# EasyEDA Pro project V2.3.2 Core.epro, board V2.3.2 PCB
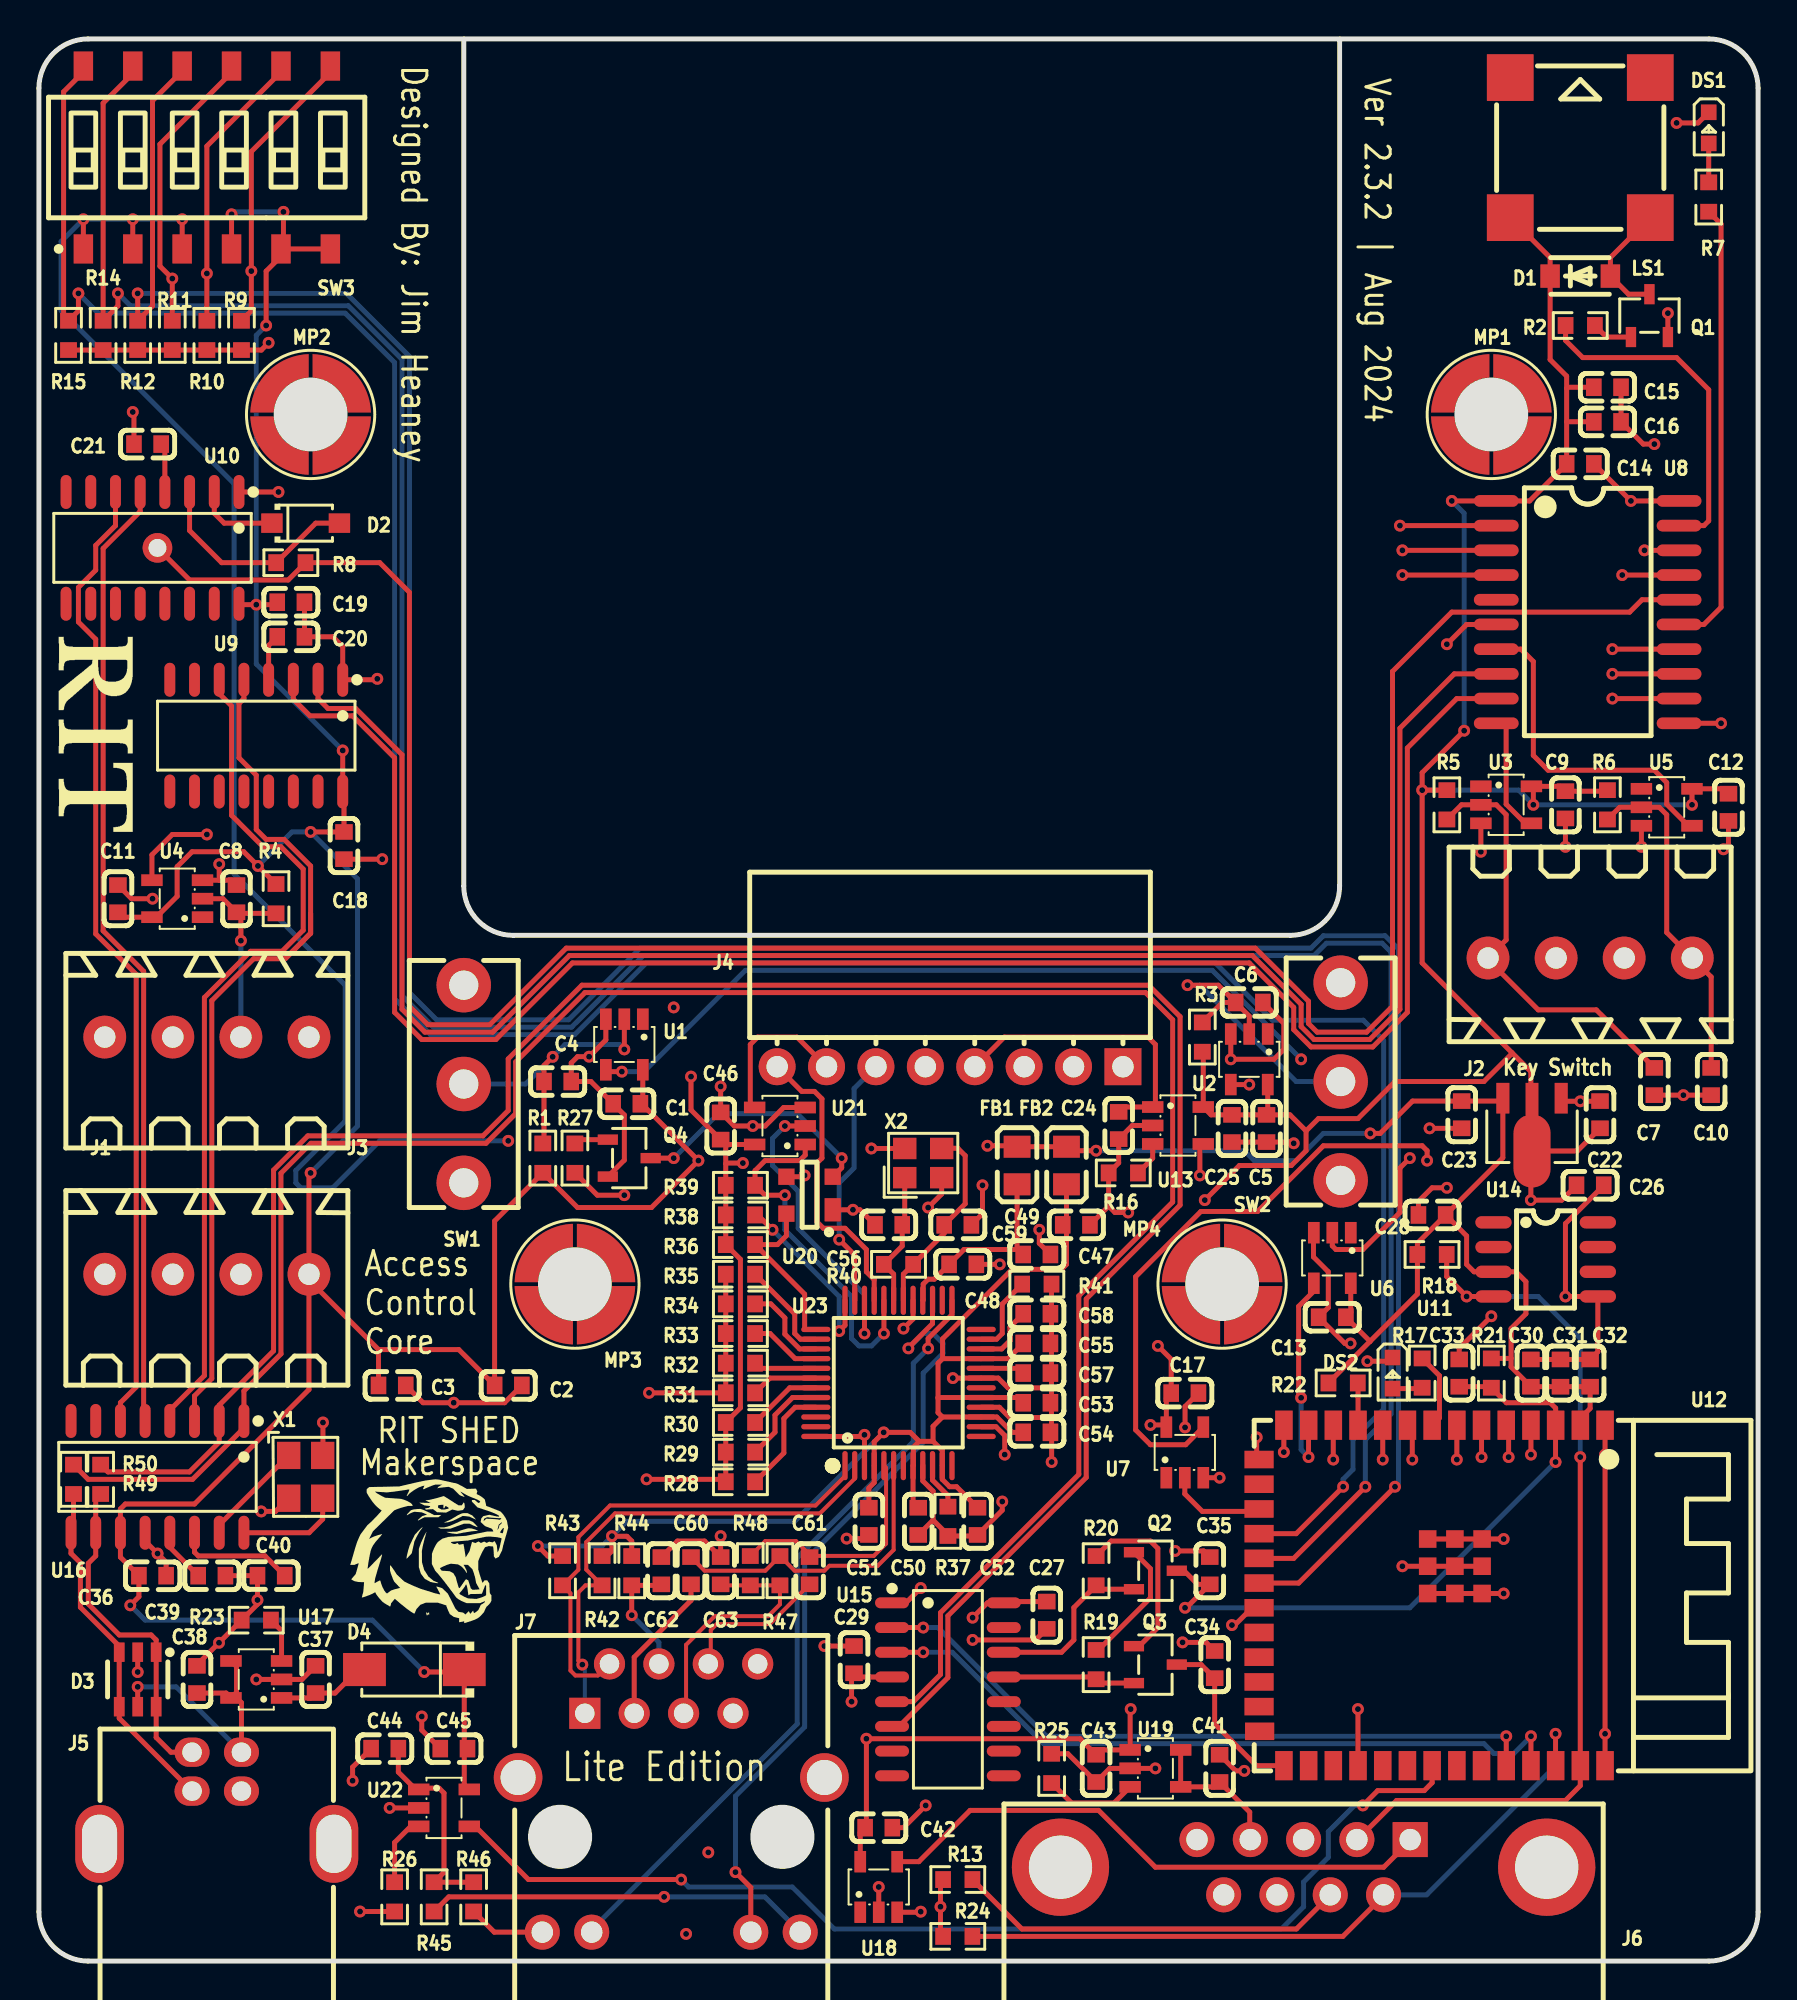
[diagram p6: board, top side]
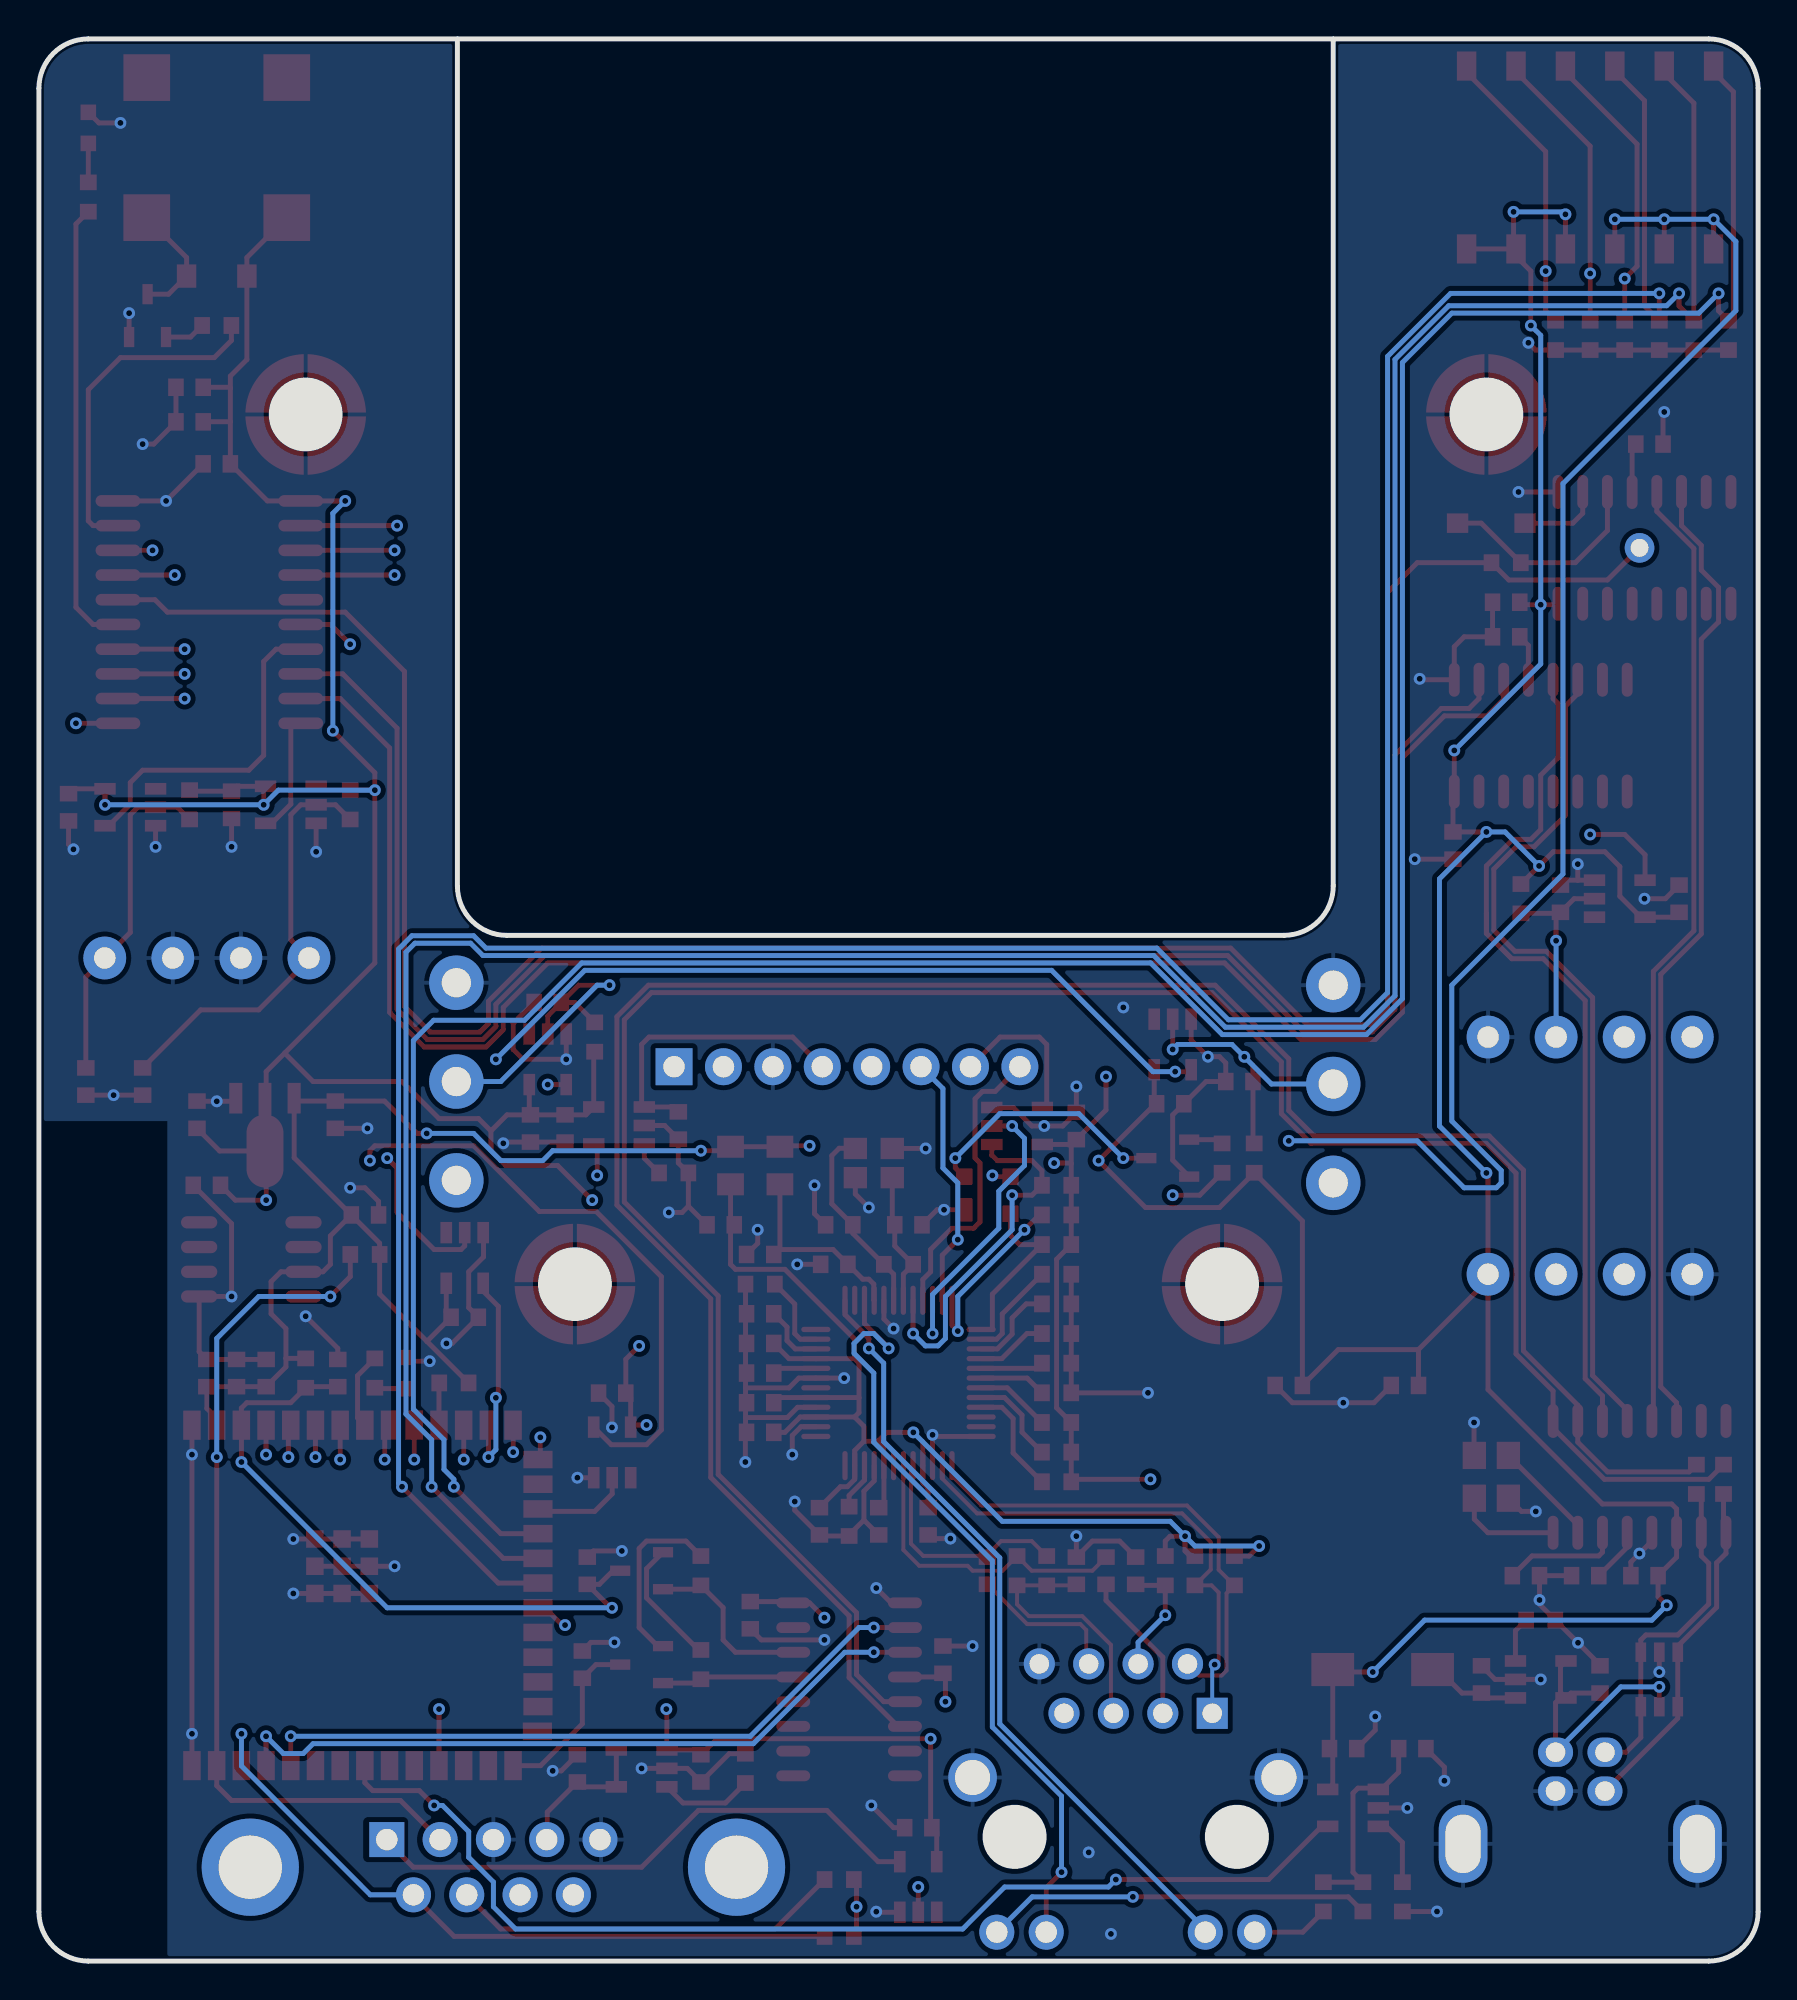
[diagram p7: board, bottom side, seen from below]

Outline 88.39 x 98.81 mm; copper layers: Top Layer, Inner1, Inner2, Bottom Layer. Coordinates in mm from the lower left corner of the outline.
Outline path: 21.84,98.81 21.84,55.27 arc(22.59,53.47) 24.38,52.73 64.34,52.73 arc(66.13,53.47) 66.88,55.27 66.88,98.81 ; 0,96.27 0,2.54 arc(0.74,0.74) 2.54,0 85.85,0 arc(87.65,0.74) 88.39,2.54 88.39,96.27 arc(87.65,98.06) 85.85,98.81 2.54,98.81 arc(0.74,98.06) 0,96.27
Stack: Top Layer 0.035mm 外层铜厚1oz / Dielectric1 0.2104mm 7628 RC49% 8.6mil / Inner1 0.0152mm 内层铜厚 / Dielectric2 1.065mm 1.1mm H/HOZ 含铜 / Inner2 0.0152mm 内层铜厚 / Dielectric3 0.2104mm 7628 RC49% 8.6mil / Bottom Layer 0.035mm 外层铜厚1oz

## Design rules (mm)
net RXP: Eth RX
net TXP: Eth TX
net DN: USB
net DP: USB
net TXN: Eth TX
net RXN: Eth RX
template: Custom Config
spacing copperThickness1oz (default): track to track 0.127, other pairs 0.152 to 0.5
spacing copperThickness2oz: track to track 0.203, other pairs 0.152 to 0.3
track width copperThickness1oz (default): min 0.127, default 0.254, max 2.54
track width copperThickness2oz: min 0.203, default 0.254, max 2.54
differential pair differentialPair (default): width min 0.127, default 0.254, max 2.54; gap min 0.152, default 0.152
via viaSize (default): diameter min 0.5, default 0.61, max 10; hole min 0.3, default 0.305, max 6.299

## Placement (name value [footprint] x y rotation side)
C1  100nF  [C0603]  30.23 44.07 180 top
C2  10uF  [C0603]  24.13 29.59 180 top
C3  10uF  [C0603]  18.16 29.59 180 top
C4  100nF  [C0603]  26.67 45.21 180 top
C5  100nF  [C0603]  63.12 42.8 270 top
C6  100nF  [C0603]  62.23 49.28 180 top
C7  100nF  [C0603]  83.06 45.21 90 top
C8  100nF  [C0603]  10.16 54.61 270 top
C9  100nF  [C0603]  78.49 59.44 90 top
C10  100nF  [C0603]  85.98 45.21 270 top
C11  100nF  [C0603]  4.06 54.61 270 top
C12  100nF  [C0603]  86.87 59.31 90 top
C13  100nF  [C0603]  66.5 33.1 0 top
C14  100nF  [C0603]  79.25 76.96 180 top
C15  10uF  [C0603]  80.65 80.9 180 top
C16  10uF  [C0603]  80.65 79.12 180 top
C17  100nF  [C0603]  58.92 29.2 180 top
C18  100nF  [C0603]  15.69 57.34 90 top
C19  100nF  [C0603]  12.95 69.85 180 top
C20  100nF  [C0603]  12.95 68.07 180 top
C21  100nF  [C0603]  5.59 77.98 0 top
C22  1uF  [C0603]  80.26 43.51 270 top
C23  4.7uF  [C0603]  73.15 43.51 90 top
C24  10uF  [C0603]  55.52 42.95 90 top
C25  10uF  [C0603]  61.34 42.8 270 top
C26  10uF  [C0603]  79.76 39.88 180 top
C27  100nF  [C0603]  51.82 17.78 90 top
C28  100nF  [C0603]  71.63 38.35 0 top
C29  100nF  [C0603]  41.91 15.49 270 top
C30  10uF  [C0603]  76.71 30.23 270 top
C31  1uF  [C0603]  78.23 30.23 270 top
C32  100nF  [C0603]  79.76 30.23 270 top
C33  1uF  [C0603]  73.03 30.23 270 top
C34  100nF  [C0603]  60.45 15.24 270 top
C35  100nF  [C0603]  60.2 20.07 270 top
C36  10uF  [C0603]  5.84 19.81 180 top
C37  10uF  [C0603]  14.22 14.48 270 top
C38  10uF  [C0603]  8.13 14.48 90 top
C39  10uF  [C0603]  8.89 19.81 180 top
C40  10uF  [C0603]  11.94 19.81 0 top
C41  10uF  [C0603]  60.71 9.91 90 top
C42  100nF  [C0603]  43.18 6.86 0 top
C43  10uF  [C0603]  54.36 9.91 90 top
C44  10uF  [C0603]  17.78 10.92 0 top
C45  10uF  [C0603]  21.34 10.92 180 top
C46  100nF  [C0603]  35.05 42.93 90 top
C47  10uF  [C0603]  51.31 36.32 180 top
C48  100nF  [C0603]  47.5 35.81 180 top
C49  10uF  [C0603]  53.34 37.85 180 top
C50  100nF  [C0603]  45.21 22.61 90 top
C51  100nF  [C0603]  42.67 22.61 90 top
C52  100nF  [C0603]  48.26 22.61 90 top
C53  100nF  [C0603]  51.31 28.7 180 top
C54  100nF  [C0603]  51.31 27.18 180 top
C55  100nF  [C0603]  51.31 31.75 180 top
C56  33pF  [C0603]  43.69 37.85 180 top
C57  4.7uF  [C0603]  51.31 30.23 180 top
C58  10nF  [C0603]  51.31 33.27 180 top
C59  33pF  [C0603]  47.24 37.85 0 top
C60  6.8nF  [C0603]  33.53 20.07 90 top
C61  6.8nF  [C0603]  39.62 20.07 90 top
C62  10nF  [C0603]  32 20.07 270 top
C63  10nF  [C0603]  35.05 20.07 270 top
D1  SM4007PL  [SOD-123F_L2.8-W1.8-LS3.7-RD]  79.25 86.61 0 top
D2  1N4148W  [SOD-123F_L2.7-W1.6-LS3.8-RD]  13.72 73.91 0 top
D3  SRV05-4-P-T7  [SOT-23-6_L2.9-W1.6-P0.95-LS2.8-BR]  5.08 14.48 90 top
D4  SS14  [SMA_L4.2-W2.6-LS5.3-RD]  19.3 14.99 180 top
DS1  KT-0603R  [LED0603-RD]  85.85 94.23 270 top
DS2  KT-0603R  [LED0603-RD]  69.6 30.23 270 top
FB1  MH2029-300Y  [L0805]  50.29 40.89 270 top
FB2  MH2029-300Y  [L0805]  52.83 40.89 270 top
J1  DB127S-3.5-4P-GN  [CONN-TH_4P-P3.50_DIBO_DB127S-3.5-4P-GN]  8.64 35.31 0 top
J2  DB127S-3.5-4P-GN  [CONN-TH_4P-P3.50_DIBO_DB127S-3.5-4P-GN]  79.76 51.56 180 top
J3  DB127S-3.5-4P-GN  [CONN-TH_4P-P3.50_DIBO_DB127S-3.5-4P-GN]  8.64 47.5 0 top
J4  PM254-1-08-W-8.5  [HDR-TH_8P-P2.54-H-F-W10.0-N]  46.85 45.97 180 top
J5  U-USBBR04P-F001  [USB-B-TH_U241-041N-1BR85-1]  9.14 8.38 0 top
J6  D-SUB-DR-9PCM-CB  [DB9-TH_ID09S33E4GV00LF]  65.02 4.83 0 top
J7  HC913129AE-907-A  [RJ45-TH_HC911102A-904-A]  32.51 8.38 0 top
LS1  2.7kHz  [BUZ-SMD_4P-L8.5-W8.5-P8.50-TL]  79.25 93.22 90 top
MP1  SMTSO2070CTJ  [SMD_BD5.6-L5.6-W5.6-D3.6]  74.68 79.5 180 top
MP2  SMTSO2070CTJ  [SMD_BD5.6-L5.6-W5.6-D3.6]  13.97 79.5 0 top
MP3  SMTSO2070CTJ  [SMD_BD5.6-L5.6-W5.6-D3.6]  27.56 34.8 0 top
MP4  SMTSO2070CTJ  [SMD_BD5.6-L5.6-W5.6-D3.6]  60.83 34.8 0 top
NOREF  -  [Pad_e105]  6.1 72.64 0 top
Q1  S8050 J3Y  [SOT-23-3_L3.0-W1.7-P0.95-LS2.9-BR]  82.8 84.58 270 top
Q2  S8050 J3Y  [SOT-23-3_L3.0-W1.7-P0.95-LS2.9-BR]  57.4 20.07 180 top
Q3  S8050 J3Y  [SOT-23-3_L3.0-W1.7-P0.95-LS2.9-BR]  57.4 15.24 180 top
Q4  S8050 J3Y  [SOT-23-3_L3.0-W1.7-P0.95-LS2.9-BR]  30.35 41.28 180 top
R1  100kΩ  [R0603]  25.91 41.28 270 top
R2  1kΩ  [R0603]  79.25 84.07 0 top
R3  100kΩ  [R0603]  59.82 47.5 270 top
R4  100kΩ  [R0603]  12.19 54.61 270 top
R5  100kΩ  [R0603]  72.39 59.44 270 top
R6  100kΩ  [R0603]  80.65 59.44 270 top
R7  4.7kΩ  [R0603]  85.85 90.68 270 top
R8  470Ω  [R0603]  12.95 71.88 180 top
R9  10kΩ  [R0603]  10.41 83.57 90 top
R10  10kΩ  [R0603]  8.64 83.57 90 top
R11  10kΩ  [R0603]  6.86 83.57 90 top
R12  10kΩ  [R0603]  5.08 83.57 90 top
R13  10kΩ  [R0603]  47.24 4.19 180 top
R14  10kΩ  [R0603]  3.3 83.57 90 top
R15  10kΩ  [R0603]  1.52 83.57 90 top
R16  10kΩ  [R0603]  55.75 40.51 180 top
R17  4.7kΩ  [R0603]  71.12 30.23 90 top
R18  4.7kΩ  [R0603]  71.63 36.32 180 top
R19  10kΩ  [R0603]  54.36 15.24 90 top
R20  10kΩ  [R0603]  54.36 20.07 90 top
R21  10kΩ  [R0603]  74.68 30.23 90 top
R22  10kΩ  [R0603]  67.06 29.72 180 top
R23  10kΩ  [R0603]  11.18 17.53 180 top
R24  5.1kΩ  [R0603]  47.24 1.27 180 top
R25  10kΩ  [R0603]  52.07 9.91 90 top
R26  10kΩ  [R0603]  18.29 3.3 270 top
R27  10kΩ  [R0603]  27.56 41.28 270 top
R28  10kΩ  [R0603]  36.07 24.64 0 top
R29  10kΩ  [R0603]  36.07 26.16 0 top
R30  10kΩ  [R0603]  36.07 27.69 0 top
R31  10kΩ  [R0603]  36.07 29.21 0 top
R32  10kΩ  [R0603]  36.07 30.73 0 top
R33  10kΩ  [R0603]  36.07 32.26 0 top
R34  10kΩ  [R0603]  36.07 33.78 0 top
R35  10kΩ  [R0603]  36.07 35.31 0 top
R36  10kΩ  [R0603]  36.07 36.83 0 top
R37  12.4kΩ  [R0603]  46.74 22.61 90 top
R38  10kΩ  [R0603]  36.07 38.35 0 top
R39  10kΩ  [R0603]  36.07 39.88 0 top
R40  1MΩ  [R0603]  44.2 35.81 180 top
R41  10kΩ  [R0603]  51.31 34.8 0 top
R42  49.9Ω  [R0603]  28.96 20.07 90 top
R43  49.9Ω  [R0603]  26.92 20.07 90 top
R44  10Ω  [R0603]  30.48 20.07 90 top
R45  1kΩ  [R0603]  20.32 3.3 90 top
R46  1kΩ  [R0603]  22.35 3.3 90 top
R47  49.9Ω  [R0603]  38.1 20.07 90 top
R48  49.9Ω  [R0603]  36.58 20.07 90 top
R49  0Ω  [R0603]  1.78 24.77 90 top
R50  0Ω  [R0603]  3.17 24.77 90 top
SW1  K9-1267F  [SW-TH_K9-1267F]  21.84 45.09 270 top
SW2  K9-1267F  [SW-TH_K9-1267F]  66.93 45.21 270 top
SW3  KH-10027B-SMT2.54-6P  [SW-SMD_KINGHELM_KH-10027B-SMT2.54-6P]  8.64 92.71 0 top
U1  SN74LVC1G17DBVR  [SOT-23-5_L3.0-W1.7-P0.95-LS2.8-BR]  30.1 47.12 90 top
U2  SN74LVC1G17DBVR  [SOT-23-5_L3.0-W1.7-P0.95-LS2.8-BR]  62.23 46.36 90 top
U3  SN74LVC1G17DBVR  [SOT-23-5_L3.0-W1.7-P0.95-LS2.8-BR]  75.44 59.44 180 top
U4  SN74LVC1G17DBVR  [SOT-23-5_L3.0-W1.7-P0.95-LS2.8-BR]  7.11 54.61 0 top
U5  SN74LVC1G17DBVR  [SOT-23-5_L3.0-W1.7-P0.95-LS2.8-BR]  83.69 59.31 180 top
U6  SN74LVC1G17DBVR  [SOT-23-5_L3.0-W1.7-P0.95-LS2.8-BR]  66.5 36.14 90 top
U7  SN74LVC1G17DBVR  [SOT-23-5_L3.0-W1.7-P0.95-LS2.8-BR]  58.92 26.15 270 top
U8  ATTINY3216-SNR  [SOIC-20_L12.8-W7.5-P1.27-LS10.3-BL]  79.63 69.34 270 top
U9  CH340C  [SOP-16_L10.0-W3.9-P1.27-LS6.0-BL]  11.18 62.99 180 top
U10  CH340C  [SOP-16_L10.0-W3.9-P1.27-LS6.0-BL]  5.84 72.64 180 top
U11  BL8565CC3BTR33  [SOT-89-3_L4.5-W2.5-P1.50-LS4.2-BR]  76.77 43 90 top
U12  2.4GHz  [WIRELM-SMD_ESP32-S3-WROOM-1]  71.63 18.8 270 top
U13  MT9700  [SOT-23-5_L3.0-W1.7-P0.95-LS2.8-BR]  58.56 42.95 180 top
U14  DS18B20Z  [SOP-8_L4.9-W3.9-P1.27-LS6.0-BL]  77.47 36.07 270 top
U15  CH340C  [SOP-16_L10.0-W3.9-P1.27-LS6.0-BL]  46.74 13.97 270 top
U16  SL2.1A  [SOP-16_L10.0-W3.9-P1.27-LS6.0-BL]  6.1 24.89 180 top
U17  MT9700  [SOT-23-5_L3.0-W1.7-P0.95-LS2.8-BR]  11.18 14.48 0 top
U18  SN74LVC1G17DBVR  [SOT-23-5_L3.0-W1.7-P0.95-LS2.8-BR]  43.18 3.81 270 top
U19  MT9700  [SOT-23-5_L3.0-W1.7-P0.95-LS2.8-BR]  57.4 9.91 180 top
U20  MAX811T  [SOT-143-4_L2.9-W1.3-P1.90-LS2.4-BL-1]  39.62 39.37 90 top
U21  SN74AHC1G125DBVR  [SOT-23-5_L3.0-W1.7-P0.95-LS2.8-BR]  38.1 42.93 0 top
U22  MT9700  [SOT-23-5_L3.0-W1.7-P0.95-LS2.8-BR]  20.83 7.87 180 top
U23  W5500  [LQFP-48_L7.0-W7.0-P0.50-LS9.0-BL]  44.2 29.72 0 top
X1  12MHz  [OSC-SMD_4P-L3.2-W2.5-BL]  13.72 24.89 270 top
X2  25MHz  [CRYSTAL-SMD_4P-L2.5-W2.0-BL]  45.47 41.02 0 top

## Footprints (pads in the part's own frame, mm; a bottom-side part is the same pattern mirrored in y, then rotated)
BUZ-SMD_4P-L8.5-W8.5-P8.50-TL
  rect 2.4x2.4 smd: 1(-3.6,3.6) 2(-3.6,-3.6) 3(3.599,-3.599) 4(3.6,3.6)
C0603
  rect 0.8x0.9 smd: 1(-0.7,0) 2(0.7,0)
CONN-TH_4P-P3.50_DIBO_DB127S-3.5-4P-GN
  round 2.2 hole 1.1: 1(-5.25,0) 2(-1.75,0) 3(1.75,0) 4(5.25,0)
CRYSTAL-SMD_4P-L2.5-W2.0-BL
  rect 1.2x1.1 smd: 1(-0.95,-0.75) 2(0.95,-0.75) 3(0.95,0.75) 4(-0.95,0.75)
DB9-TH_ID09S33E4GV00LF
  rect 1.8x1.8 hole 1.1: 1(5.48,1.42)
  round 1.8 hole 1.1: 2(2.74,1.42) 3(0,1.42) 4(-2.74,1.42) 5(-5.48,1.42) 6(4.11,-1.42) 7(1.37,-1.42) 8(-1.37,-1.42) 9(-4.11,-1.42)
  round 5 hole 3.25: 10(-12.5,0) 11(12.5,0)
HDR-TH_8P-P2.54-H-F-W10.0-N
  rect 1.9x1.9 hole 1.1: 1(-8.89,0)
  round 1.9 hole 1.1: 2(-6.35,0) 3(-3.81,0) 4(-1.27,0) 5(1.27,0) 6(3.81,0) 7(6.35,0) 8(8.89,0)
L0805
  rect 1.133x1.377 smd: 1(-0.966,0) 2(0.966,0)
LED0603-RD
  rect 0.8x0.8 smd: 1(-0.799,0) 2(0.799,0)
LQFP-48_L7.0-W7.0-P0.50-LS9.0-BL
  oval 0.27x1.5 smd: 1(-2.75,-4.25) 2(-2.25,-4.25) 3(-1.75,-4.25) 4(-1.25,-4.25) 5(-0.75,-4.25) 6(-0.25,-4.25) 7(0.25,-4.25) 8(0.75,-4.25) 9(1.25,-4.25) 10(1.75,-4.25) 11(2.25,-4.25) 12(2.75,-4.25) 25(2.75,4.25) 26(2.25,4.25) 27(1.75,4.25) 28(1.25,4.25) 29(0.75,4.25) 30(0.25,4.25) 31(-0.25,4.25) 32(-0.75,4.25) 33(-1.25,4.25) 34(-1.75,4.25) 35(-2.25,4.25) 36(-2.75,4.25)
  oval 1.5x0.27 smd: 13(4.25,-2.75) 14(4.25,-2.25) 15(4.25,-1.75) 16(4.25,-1.25) 17(4.25,-0.75) 18(4.25,-0.25) 19(4.25,0.25) 20(4.25,0.75) 21(4.25,1.25) 22(4.25,1.75) 23(4.25,2.25) 24(4.25,2.75) 37(-4.25,2.75) 38(-4.25,2.25) 39(-4.25,1.75) 40(-4.25,1.25) 41(-4.25,0.75) 42(-4.25,0.25) 43(-4.25,-0.25) 44(-4.25,-0.75) 45(-4.25,-1.25) 46(-4.25,-1.75) 47(-4.25,-2.25) 48(-4.25,-2.75)
OSC-SMD_4P-L3.2-W2.5-BL
  rect 1.4x1.2 smd: 1(-1.1,-0.875) 2(1.1,-0.875) 3(1.1,0.875) 4(-1.1,0.875)
Pad_e105
  round 1.524 hole 0.914: 49(0,0)
R0603
  rect 0.806x0.864 smd: 1(-0.753,0) 2(0.753,0)
RJ45-TH_HC911102A-904-A
  rect 1.6x1.6 hole 1: 1(-4.445,4.355)
  round 1.6 hole 1: 2(-3.175,6.895) 3(-1.905,4.355) 4(-0.635,6.895) 5(0.635,4.355) 6(1.905,6.895) 7(3.175,4.355) 8(4.445,6.895)
  round 1.8 hole 1.1: 9(-6.63,-6.895) 10(-4.09,-6.895) 11(4.09,-6.895) 12(6.63,-6.895)
  round 2.5 hole 1.8: 13(-7.875,1.055) 13(7.875,1.055)
SMA_L4.2-W2.6-LS5.3-RD
  rect 2.2x1.7 smd: 1(-2.566,0) 2(2.566,0)
SMD_BD5.6-L5.6-W5.6-D3.6
  custom 3x3 smd: 1(-1.844,1.6) 1(-1.601,-1.844) 1(1.6,1.844) 1(1.844,-1.6)
SOD-123F_L2.7-W1.6-LS3.8-RD
  rect 1.1x1 smd: 1(-1.735,0) 2(1.735,0)
SOD-123F_L2.8-W1.8-LS3.7-RD
  rect 1x1.2 smd: 1(-1.55,0) 2(1.55,0)
SOIC-20_L12.8-W7.5-P1.27-LS10.3-BL
  oval 0.6x2.3 smd: 1(-5.715,-4.7) 2(-4.445,-4.7) 3(-3.175,-4.7) 4(-1.905,-4.7) 5(-0.635,-4.7) 6(0.635,-4.7) 7(1.905,-4.7) 8(3.175,-4.7) 9(4.445,-4.7) 10(5.715,-4.7) 11(5.715,4.7) 12(4.445,4.7) 13(3.175,4.7) 14(1.905,4.7) 15(0.635,4.7) 16(-0.635,4.7) 17(-1.905,4.7) 18(-3.175,4.7) 19(-4.445,4.7) 20(-5.715,4.7)
SOP-8_L4.9-W3.9-P1.27-LS6.0-BL
  oval 0.63x1.865 smd: 1(-1.905,-2.683) 2(-0.635,-2.683) 3(0.635,-2.683) 4(1.905,-2.683) 5(1.905,2.683) 6(0.635,2.683) 7(-0.635,2.683) 8(-1.905,2.683)
SOP-16_L10.0-W3.9-P1.27-LS6.0-BL
  oval 0.56x1.745 smd: 1(-4.445,-2.873) 2(-3.175,-2.873) 3(-1.905,-2.873) 4(-0.635,-2.873) 5(0.635,-2.873) 6(1.905,-2.873) 7(3.175,-2.873) 8(4.445,-2.873) 9(4.445,2.873) 10(3.175,2.873) 11(1.905,2.873) 12(0.635,2.873) 13(-0.635,2.873) 14(-1.905,2.873) 15(-3.175,2.873) 16(-4.445,2.873)
SOT-23-3_L3.0-W1.7-P0.95-LS2.9-BR
  rect 1.038x0.532 smd: 1(1.101,-0.95) 2(1.101,0.95) 3(-1.101,0)
SOT-23-5_L3.0-W1.7-P0.95-LS2.8-BR
  rect 1.1x0.6 smd: 1(1.3,-0.95) 2(1.3,0) 3(1.3,0.95) 4(-1.3,0.95) 5(-1.3,-0.95)
SOT-23-6_L2.9-W1.6-P0.95-LS2.8-BR
  rect 1x0.55 smd: 1(1.4,-0.95) 2(1.4,0) 3(1.4,0.95) 4(-1.4,0.95) 5(-1.4,0) 6(-1.4,-0.95)
SOT-89-3_L4.5-W2.5-P1.50-LS4.2-BR
  rect 1.575x0.672 smd: 1(1.356,-1.5) 3(1.356,1.5)
  custom 5.377x1.9 smd: 2(-1.356,0)
SOT-143-4_L2.9-W1.3-P1.90-LS2.4-BL-1
  rect 1.194x0.838 smd: 1(-0.75,-1.192)
  rect 0.838x0.838 smd: 2(0.95,-1.192) 3(-0.95,1.192) 4(0.95,1.192)
SW-SMD_KINGHELM_KH-10027B-SMT2.54-6P
  rect 1x1.5 smd: 1(-6.35,-4.7) 2(-3.81,-4.7) 3(-1.27,-4.7) 4(1.27,-4.7) 5(3.81,-4.7) 6(6.35,-4.7) 7(6.35,4.7) 8(3.81,4.7) 9(1.27,4.7) 10(-1.27,4.7) 11(-3.81,4.7) 12(-6.35,4.7)
SW-TH_K9-1267F
  round 2.8 hole 1.5: 1(-5.08,0) 2(0,0) 3(5.08,0)
USB-B-TH_U241-041N-1BR85-1
  oval 1.8x1.5 hole 1: 1(1.27,2.355) 2(-1.27,2.355) 3(-1.27,0.355) 4(1.27,0.355)
  oval 2.5x4 hole 1.8x3: 5(6.025,-2.355) 6(-6.025,-2.355)
WIRELM-SMD_ESP32-S3-WROOM-1
  rect 1.5x0.9 smd: 1(-8.75,8.895) 2(-8.75,7.625) 3(-8.75,6.355) 4(-8.75,5.085) 5(-8.75,3.815) 6(-8.75,2.545) 7(-8.75,1.275) 8(-8.75,0.005) 9(-8.75,-1.265) 10(-8.75,-2.535) 11(-8.75,-3.805) 12(-8.75,-5.075) 13(-8.75,-6.345) 14(-8.75,-7.615) 27(8.75,-7.615) 28(8.75,-6.345) 29(8.75,-5.075) 30(8.75,-3.805) 31(8.75,-2.535) 32(8.75,-1.265) 33(8.75,0.005) 34(8.75,1.275) 35(8.75,2.545) 36(8.75,3.815) 37(8.75,5.085) 38(8.75,6.355) 39(8.75,7.625) 40(8.75,8.895)
  rect 0.9x1.5 smd: 15(-6.985,-8.895) 16(-5.715,-8.895) 17(-4.445,-8.895) 18(-3.175,-8.895) 19(-1.905,-8.895) 20(-0.635,-8.895) 21(0.635,-8.895) 22(1.905,-8.895) 23(3.175,-8.895) 24(4.445,-8.895) 25(5.715,-8.895) 26(6.985,-8.865)
  rect 0.9x0.9 smd: 41(-2.9,2.575) 41(-2.9,1.175) 41(-2.9,-0.225) 41(-1.5,2.575) 41(-1.5,1.175) 41(-1.5,-0.225) 41(-0.1,2.575) 41(-0.1,1.175) 41(-0.1,-0.225)

## Nets
As in the schematic, except:
GND: C1.2 C2.1 C3.1 C4.1 C5.2 C6.1 C7.1 C8.1 C9.1 C10.2 C11.1 C12.1 C13.1 C14.1 C15.1 C16.1 C17.1 C18.1 C19.1 C20.1 C21.1 C22.1 C23.1 C24.1 C25.2 C26.1 C27.1 C28.1 C29.1 C30.1 C31.1 C32.1 C33.1 C34.1 C35.1 C36.1 C37.1 C38.2 C39.1 C40.1 C41.2 C42.2 C43.1 C44.1 C45.2 C46.2 C47.1 C48.1 C49.1 C50.1 C51.1 C52.1 C53.1 C54.1 C55.1 C56.2 C57.1 C58.1 C59.2 C62.1 C63.1 D3.2 DS1.1 DS2.1 J1.1 J2.2 J2.3 J3.4 J4.3 J5.4 J5.5 J5.6 J6.3 J6.5 J7.8 J7.13 Q1.2 Q4.2 R9.1 R10.1 R11.1 R12.1 R14.1 R15.1 R16.2 R23.2 R25.2 R26.2 R31.1 R32.1 R33.1 R34.1 R35.1 R37.1 R41.2 SW1.1 SW2.1 U1.3 U2.3 U3.3 U4.3 U5.3 U6.3 U7.3 U8.20 U9.1 U10.1 U11.1 U12.1 U12.40 U12.41 U13.2 U14.5 U15.1 U16.12 U17.2 U18.3 U19.2 U20.1 U21.3 U22.2 U23.3 U23.9 U23.14 U23.16 U23.19 U23.29 U23.48 X1.2 X1.4 X2.2 X2.4
VCC: C13.2 C23.2 C27.2 C28.2 C29.2 C30.2 C31.2 C32.2 C46.1 FB1.1 FB2.1 R13.2 R18.2 R21.2 R22.2 R24.2 R28.1 R29.1 R30.1 R36.1 R38.1 R39.1 SW3.1 SW3.2 SW3.3 U6.5 U11.3 U12.2 U14.3 U15.4 U15.16 U21.5
DN: D3.1 D3.6 J5.2 R50.1 U16.10
DN1: R50.2 U15.6 U16.2
DN2: U10.6 U16.6
DN3: U9.6 U16.4
DP: D3.3 D3.4 J5.3 R49.1 U16.9
DP1: R49.2 U15.5 U16.1
DP2: U10.5 U16.5
DP3: U9.5 U16.3
ETH_LEDS: U12.33 U22.4
UPDI: NOREF.49 R8.1 U8.16

Pads without a net: J1 2; J3 1 2; J6 8 9 10 11; J7 7; LS1 3 4; MP1 1; MP2 1; MP3 1; MP4 1; SW1 3; SW2 3; U1 1; U2 1; U3 1; U4 1; U5 1; U6 1; U7 1; U8 5; U9 7 8 9 10 11 12 13 14 15; U10 7 8 9 10 11 12 13 14 15; U12 16 22 23 24 25 26 28 29 31 32 34 35; U14 1 2 6 7 8; U15 7 8 9 10 11 12 15; U16 7 8; U18 1; U23 7 12 13 18 24 26 46 47

## Via types
v1: diameter 0.61, hole 0.305, Top Layer to Bottom Layer, 186 vias

## Routing (per net, layer and track width the routed paths; a pad name or vN(x,y) marks a point on that pad's centre or on a via; arc(x,y) is an arc through that point)
+5V: length 380.6
  Top Layer w0.254: v1(15.62,62.23) 15.62,60.12 15.69,60.05 C18.2 v1(13.97,58.04) ; v1(84.99,59.44) 84.99,60.26 86.62,60.26 C12.2 ; v1(57.53,31.62) 58.22,30.94 C17.2 57.97,28.95 U7.5 57.85,27.56 v1(57.15,27.56) ; 65.15,42.67 65.15,41.66 64.39,40.89 61.72,40.89 v1(59.94,39.12) ; 65.15,42.67 64.32,43.5 C5.1 ; 65.15,42.67 65.79,43.31 67.82,43.31 69.72,45.21 74.29,45.21 75.74,46.66 75.74,46.69 ; U11.2 76.71,41.58 v1(76.71,39.12) 78.29,39.12 C26.2 ; U11.2 76.71,41.7 76.71,45.72 75.74,46.69 ; U11.2 79.1,41.64 C22.2 ; R6.1 80.59,60.14 C9.2 78.24,60.39 U3.5 76.84,60.29 v1(76.84,59.44) ; 78.55,79.13 C14.2 76.64,75.06 U8.1 v1(72.64,75.06) ; 78.55,79.13 78.55,80.85 ; 78.55,79.13 79.94,79.13 79.94,79.12 ; SW3.5 12.57,88.14 v1(12.57,89.92) ; SW3.5 SW3.6 ; SW3.5 12.45,87.63 11.68,86.87 v1(11.68,84.07) ; v1(71.12,60.19) 71.12,61.09 v1(73.28,63.25) ; v1(71.12,60.19) 71.12,51.31 75.74,46.69 ; v1(71.12,60.19) R5.1 ; 13.89,35.01 13.89,29.38 8,23.5 4.44,23.5 4.19,23.24 U16.11 4.19,20.76 C36.2 5.14,18.73 v1(4.7,18.29) ; 13.89,35.01 17.46,31.43 ; 13.89,35.01 J1.4 13.89,40.43 v1(13.97,40.51) ; 78.55,80.85 78.59,80.9 79.94,80.9 ; 78.55,80.85 78.55,81.47 77.7,82.32 D1.1 77.7,87.57 LS1.1 ; C5.1 63.18,43.56 63.18,45.06 ; C5.1 C25.1 60.27,43.5 U13.5 59.87,46.57 59.69,46.74 ; v1(19.81,14.86) 21.74,14.86 D4.1 21.87,9.08 U22.5 ; 17.46,31.43 C3.2 ; 17.46,31.43 21.59,31.43 C2.2 23.43,38.04 R1.2 27.69,38.74 31.5,38.74 v1(33.91,41.15) 30.99,44.07 C1.1 31.05,44.19 U1.5 ; v1(39.37,40.39) 39.3,40.32 U20.4 ; v1(56.13,12.95) 56.1,12.92 U19.1 54.61,10.86 C43.2 53.53,11.43 v1(42.54,11.43) 42.54,6.92 C42.1 42.23,6.61 U18.5 ; C11.2 4.31,53.66 U4.5 6.03,53.66 7.11,54.73 7.11,56.26 7.87,57.02 10.53,57.02 v1(11.26,56.29) R4.1 ; SW3.4 v1(9.91,89.79) ; U10.16 10.29,69.72 v1(11.18,69.72) 12.13,69.72 C19.2
  Inner2 w0.254: v1(57.53,31.62) 57.53,36.7 v1(59.94,39.12) ; v1(33.91,41.15) 34.67,40.39 v1(39.37,40.39) ; v1(42.54,11.43) 41.78,12.19 39.88,12.19 38.48,10.8 26.92,10.8 22.86,14.86 v1(19.81,14.86)
  Inner2 w0.508: v1(57.15,27.56) 56.13,26.54 v1(56.13,12.95)
  Bottom Layer w0.254: v1(11.26,56.29) 13.01,58.04 v1(13.97,58.04) 16.38,55.63 16.38,42.93 v1(13.97,40.51) ; v1(15.62,62.23) 11.18,66.68 v1(11.18,69.72) 11.18,83.57 v1(11.68,84.07) ; v1(4.7,18.29) 5.46,17.53 17.14,17.53 v1(19.81,14.86) ; v1(9.91,89.79) 10.03,89.92 v1(12.57,89.92) ; v1(72.64,75.06) 73.28,74.42 v1(73.28,63.25) ; v1(84.99,59.44) v1(76.84,59.44) 76.08,60.19 v1(71.12,60.19)
AVDD: length 71.4
  Top Layer w0.254: C53.2 50.34,28.97 U23.17 46.24,28.97 46.23,28.96 ; 46.46,30.97 U23.21 49.83,30.97 C55.2 ; 46.46,30.97 46.23,30.73 46.23,28.96 ; 46.46,30.97 46.46,31.98 50.04,35.56 52.58,35.56 52.83,35.81 52.83,37.65 C49.2 52.83,38.04 FB2.2 ; 46.45,27.97 U23.15 49.25,27.97 50.04,27.18 C54.2 ; 46.45,27.97 45.97,27.49 45.97,26.72 ; 46.45,27.97 46.23,28.19 46.23,28.96 ; R44.2 30.48,21.59 30.23,21.84 29.46,21.84 ; 29.46,21.84 29.46,21.08 29.2,20.82 R42.2 ; 29.46,21.84 v1(29.46,21.84) ; C51.2 42.67,24.32 42.95,24.59 U23.4 42.95,26.69 v1(43.43,27.18) 44.8,27.18 45.26,26.72 ; C50.2 44.95,23.57 U23.8 44.96,25.48 44.96,26.42 45.26,26.72 ; 45.97,26.72 45.26,26.72 ; 45.97,26.72 46.45,26.25 U23.11 46.45,24.76 46.82,24.38 47.18,24.38 C52.2 ; v1(25.65,21.34) 26.17,20.82 R43.2
  Bottom Layer w0.254: v1(25.65,21.34) 28.96,21.34 v1(29.46,21.84) 30.23,22.61 38.86,22.61 v1(43.43,27.18)
GND: length 266.8
  Top Layer w0.254: U7.3 v1(60.71,24.85) ; C10.2 v1(84.55,44.51) C7.1 ; C62.1 32.83,21.59 34.23,21.59 C63.1 v1(35.05,21.84) ; U12.40 v1(80.52,11.68) v1(80.52,26.04) U12.1 ; C12.1 86.87,57.4 v1(86.61,57.15) ; v1(49.4,35.81) C48.1 ; C59.2 48.51,38.42 v1(48.51,39.88) ; C21.1 4.89,79.57 v1(4.83,79.63) ; 52.06,27.23 52.07,27.22 v1(52.07,25.65) ; 52.06,27.23 C54.1 ; 52.06,27.23 52.06,27.95 ; C3.1 19.75,28.7 v1(21.33,28.7) 23.94,28.7 C2.1 ; R15.1 R14.1 R12.1 R11.1 R10.1 R9.1 11.44,82.81 v1(11.81,83.19) ; 9.27,55.56 9.91,55.56 C8.1 ; 9.27,55.56 U4.3 ; 9.27,55.56 v1(9.27,56.39) ; v1(49.66,26.04) 49.66,27.02 49.21,27.47 U23.14 ; v1(45.72,38.74) 46.42,39.43 X2.2 ; U23.16 49.38,28.47 49.91,27.94 52.05,27.94 52.06,27.95 ; v1(61.98,9.78) 61.53,9.78 C41.2 ; v1(70.1,20.3) U12.41 U12.41 74.2,20.3 ; X2.4 v1(42.8,41.77) ; v1(49.53,23.62) 49.53,23.18 C52.1 48.21,21.85 R37.1 46.74,21.91 45.97,22.67 ; DS1.1 85.31,94.49 v1(84.2,94.49) ; C49.1 55,38.81 ; 55,38.81 R16.2 55.52,41.03 C24.1 56.22,42.95 U13.2 ; 55,38.81 55.32,38.48 v1(56.01,38.48) ; v1(44.45,32.51) 44.95,33.01 U23.29 ; v1(74.68,33.15) 73.03,31.5 C33.1 ; C37.1 13.52,14.48 U17.2 v1(11.18,14.48) ; U3.3 v1(74.14,57.02) ; U20.1 v1(41.85,38.62) 42.21,38.62 C56.2 ; v1(67.44,31.75) 67.14,31.75 C13.1 66.29,33.59 66.29,35.43 65.53,36.2 65.53,37.43 U6.3 ; C30.1 C31.1 C32.1 80.15,31.32 U14.5 v1(78.49,34.16) 78.49,37.91 C26.1 ; v1(35.05,44.96) C46.2 35.75,42.93 v1(36.7,42.93) 37.34,42.93 38.29,43.88 U21.3 ; U8.20 v1(81.85,75.06) C14.1 ; v1(58.42,21.08) 59.88,21.08 C35.1 ; v1(17.4,65.91) 17.35,65.86 15.62,65.86 15.62,67.56 15.11,68.07 C20.1 C19.1 ; v1(64.52,42.04) 64.45,42.1 C5.2 C25.2 ; v1(45.34,2.54) 45.31,2.51 U18.3 ; C45.2 19.69,11.87 v1(19.69,12.57) ; 29.25,40.33 30.1,41.17 30.1,43.5 C1.2 28.38,45.21 C4.1 27.37,46.17 27.69,46.49 v1(28.29,46.49) 29.15,47.35 U1.3 ; X1.4 14.61,26.01 v1(14.61,27.69) ; 45.97,22.67 C50.1 ; 45.97,22.67 45.97,24.16 45.45,24.68 U23.9 ; v1(48.01,16.51) 51.25,16.51 C27.1 ; v1(46.99,29.97) U23.19 49.32,29.97 49.83,29.46 52.04,29.46 52.06,29.48 ; C29.1 v1(40.39,16.19) ; v1(57.4,9.91) U19.2 55.06,9.91 C43.1 52.9,10.66 R25.2 ; v1(58.93,27.43) 58.93,28.51 C17.1 ; C36.1 6.54,20.51 v1(6.1,20.95) 5.46,21.59 U16.12 ; U23.48 42.36,26.97 v1(42.45,27.05) U23.3 ; 52.06,29.48 52.06,27.95 ; 52.06,29.48 R41.2 ; v1(83.06,77.98) 82.49,77.98 C16.1 C15.1 ; v1(75.31,21.7) U12.41 U12.41 ; v1(5.84,54.61) 4.76,54.61 C11.1 ; Q1.2 v1(83.75,84.71) ; C38.2 8.13,15.23 v1(9.26,16.36) R23.2 11.24,18.34 C40.1 C39.1 ; v1(45.34,19.18) 44.58,18.42 U15.1 ; U2.3 v1(61.28,46.36) 63.5,46.36 64.01,46.86 64.01,48.2 C6.1 ; X1.2 12.16,23.11 v1(11.43,23.11) ; C28.1 70.93,39.05 71.63,39.75 v1(72.39,39.75) ; R26.2 v1(16.51,2.55) ; v1(16.13,9.27) 16.13,9.97 C44.1 ; v1(5.08,14.86) D3.2 ; U12.41 U12.41 v1(75.31,18.9) ; C42.2 44.45,6.86 v1(45.59,8) ; v1(51.44,37.59) 51.44,36.9 C47.1 ; U5.3 v1(82.39,57.28) ; C22.1 80.25,44.2 v1(79.25,44.2) 78.43,44.2 78.27,44.36 ; v1(41.53,21.72) 42.48,21.72 C51.1 ; U22.2 v1(18.03,7.87) ; DS2.1 69.41,30.84 v1(68.3,30.84) ; C23.1 v1(71.5,42.81) ; C9.1 v1(78.49,57.28) ; C18.1 v1(17.65,56.64) ; v1(58.8,16.38) 60.01,16.38 C34.1 ; R35.1 R34.1 R33.1 R32.1 R31.1 v1(31.37,29.21) ; U10.1 v1(12.32,75.52)
  Bottom Layer w0.254: v1(75.31,18.9) 75.31,18.92 ; v1(74.14,57.02) 74.04,57.02 ; v1(61.28,46.36) 61.34,46.36
  vias: v1(11.24,18.56) v1(32.64,49.02) v1(33.27,1.4) v1(34.42,5.59)
VCC: length 264.2
  Top Layer w0.254: 68.44,31.85 70.87,34.29 R18.2 70.87,36.9 C28.2 ; 68.44,31.85 68.44,31.86 C13.2 67.45,33.35 U6.5 ; 68.44,31.85 R22.2 ; R21.2 75.69,30.98 75.69,30.99 ; C27.2 49.67,18.48 U15.16 48.77,18.42 v1(48.01,17.65) ; v1(68.45,42.55) 68.96,42.55 70.62,44.21 C23.2 75.12,44.21 75.27,44.36 75.27,41.29 C28.2 ; v1(54.36,41.66) 53.04,41.66 FB2.1 FB1.1 50.24,41.91 v1(48.77,41.91) ; C28.2 73.41,37.28 73.41,35.81 73.79,35.43 U14.3 75.95,35.43 76.45,34.93 76.45,33.27 75.69,32.51 75.69,30.99 ; 35.3,41.98 35.31,41.96 35.31,40.99 ; 35.3,41.98 C46.1 33.53,43.75 v1(33.53,45.47) ; 35.3,41.98 U21.5 ; 35.31,40.99 35.35,41.02 v1(36.19,41.02) ; 35.31,40.99 R39.1 R38.1 R36.1 36.07,36.08 36.07,28.44 R30.1 R29.1 R28.1 35.19,24.77 v1(31.24,24.77) ; R24.2 46.35,1.41 v1(46.35,2.79) 46.35,4.06 R13.2 ; v1(4.83,89.54) SW3.2 ; SW3.1 v1(2.29,89.54) ; v1(41.78,13.34) 41.78,14.67 C29.2 42.1,14.61 43.86,14.61 ; 75.69,30.99 75.69,30.54 C30.2 C31.2 C32.2 79.76,28.41 79.25,27.91 U12.2 ; v1(7.37,89.54) SW3.3
  Inner2 w0.254: v1(41.78,13.34) 46.35,8.76 v1(46.35,2.79) ; v1(41.78,13.34) 46.1,13.34 47.12,14.35 47.12,16.76 v1(48.01,17.65) ; v1(41.78,13.34) 41.78,19.05 36.07,24.77 v1(31.24,24.77) ; v1(36.19,41.02) 39.88,41.02 40.89,40.01 40.89,38.35 42.16,37.08 42.16,34.29 43.18,33.27 45.97,33.27 49.28,36.58 49.28,41.4 v1(48.77,41.91) ; v1(33.53,45.47) 30.23,42.16 v1(24.13,42.16)
  Bottom Layer w0.254: v1(68.45,42.55) 66.04,42.55 64.64,41.15 62.48,41.15 61.98,41.66 v1(54.36,41.66) ; v1(7.37,89.54) v1(4.83,89.54) v1(2.29,89.54) 1.14,88.39 1.14,84.84 10.03,75.95 10.03,55.88 15.75,50.17 15.75,43.18 13.21,40.64 13.21,40.01 13.46,39.75 15.11,39.75 17.53,42.16 v1(24.13,42.16)
VDD: length 10.2
  Top Layer w0.254: FB1.2 50.29,36.64 50.35,36.58 ; U23.28 45.47,33.99 45.47,34.8 45.72,35.05 46.04,35.05 C48.2 47.56,36.58 50.35,36.58 ; 50.35,36.58 C47.2
BUTTON: length 95.1
  Top Layer w0.254: U4.4 5.81,56.87 6.86,57.91 v1(8.64,57.91) ; v1(72.39,67.69) 73.41,68.71 U8.6
  Inner2 w0.254: v1(8.64,57.91) 19.48,47.07 27.48,47.07 28.29,47.88 57.07,47.88 57.58,47.37 68.71,47.37 69.85,48.51 69.85,58.14 69.09,58.9 69.09,64.39 v1(72.39,67.69)
BUZZER: length 17.5
  Top Layer w0.254: R2.1 78.49,83.3 79.38,82.42 84.2,82.42 85.85,80.77 85.85,74.03 85.61,73.79 U8.19
DB9_INT: length 34.8
  Top Layer w0.254: 67.82,10.05 67.82,10.05 v1(67.82,12.95) ; 66.41,3.41 64.65,1.65 50.54,1.65 R13.1
  Inner2 w0.254: 66.41,3.41 67.03,3.41 69.22,5.59 69.22,11.56 v1(67.82,12.95)
DEBUG_LED: length 4
  Top Layer w0.254: U12.8 72.01,27.92 72.01,30.09 R17.2
DIP1: length 149.6
  Top Layer w0.254: v1(2.03,85.73) 2.03,84.83 R15.2 1.27,84.57 1.27,96.09 2.29,97.1 SW3.12 ; v1(67.06,24.38) 64.64,21.97 62.73,21.97
  Bottom Layer w0.254: v1(67.06,24.38) 67.06,24.77 67.56,25.27 67.56,26.8 69.14,28.37 69.14,47.32 68.1,48.36 63.43,48.36 60.48,51.31 31.23,51.31 27.55,47.63 20.13,47.63 18.29,49.47 18.29,82.17 15.75,84.71 3.05,84.71 v1(2.03,85.73)
DIP2: length 152.7
  Top Layer w0.254: SW3.11 4.83,97.03 3.3,95.5 R14.2 4.06,85.08 v1(4.06,85.73) ; v1(68.2,24.38) 64.52,20.7 U12.19
  Bottom Layer w0.254: v1(4.06,85.73) 4.7,85.09 15.91,85.09 18.67,82.33 18.67,49.63 20.29,48.01 27.39,48.01 31.07,51.69 65.56,51.69 66.2,52.32 69.06,52.32 69.52,51.86 69.52,28.12 68.2,26.8 v1(68.2,24.38)
DIP3: length 153.7
  Top Layer w0.254: v1(5.08,85.73) R12.2 5.84,85.08 5.84,95.63 7.37,97.16 SW3.10 ; U12.20 64.77,19.43 v1(69.72,24.38)
  Bottom Layer w0.254: v1(5.08,85.73) 15.81,85.73 19.05,82.48 19.05,49.78 20.45,48.39 27.23,48.39 30.91,52.07 65.41,52.07 66.04,52.71 69.22,52.71 69.9,52.02 69.9,24.56 v1(69.72,24.38)
DIP4: length 146.5
  Top Layer w0.254: R11.2 v1(6.86,86.49) 6.22,87.12 6.22,93.4 9.91,97.08 SW3.9 ; U8.4 v1(70.1,71.25)
  Inner2 w0.254: v1(70.1,71.25) 68.71,69.85 68.71,58.74 69.47,57.98 69.47,48.67 68.55,47.75 59.18,47.75 55.75,51.18 31.05,51.18 27.32,47.45 19.64,47.45 18.29,48.8 18.29,85.03 17.46,85.85 7.49,85.85 v1(6.86,86.49)
DIP5: length 145.3
  Top Layer w0.254: R10.2 v1(8.64,86.75) 8.64,93.29 12.45,97.1 SW3.8 ; U8.3 v1(70.1,72.52)
  Inner2 w0.254: v1(8.64,86.75) 9.15,86.23 17.62,86.23 18.67,85.19 18.67,48.96 19.8,47.83 27.16,47.83 30.9,51.56 55.91,51.56 59.34,48.13 68.39,48.13 69.09,48.83 69.09,57.82 68.33,58.58 68.33,70.74 v1(70.1,72.52)
DN: length 17.3
  Top Layer w0.254: 7.87,10.74 6.79,10.74 6.03,11.5 D3.6 D3.1 6.03,16.51 5.77,16.76 4.13,16.76 2.54,18.35 2.54,20.45 2.92,20.83 2.92,23.76 R50.1
DN1: length 117.6
  Top Layer w0.254: R50.2 3.55,25.15 7.74,25.15 9.27,26.67 U16.2 9.27,28.58 12.06,31.37 12.06,40.66 13.83,42.42 22.83,42.42 24.13,43.72 24.13,46.38 27.92,50.17 57.05,50.17 58.67,48.55 58.67,38.86 53.85,34.04 53.85,24.86 46.74,17.75 46.74,14.57 44.23,12.06 U15.6
DN2: length 50.1
  Top Layer w0.254: U10.6 3.94,73.79 2.92,72.77 2.92,71.5 2.03,70.61 2.03,68.83 2.92,67.95 2.92,52.8 5,50.72 5,29.52 4.19,28.7 U16.6
DN3: length 44.2
  Top Layer w0.254: U16.4 6.73,28.32 8.51,30.1 8.51,49.53 10.89,51.91 12.51,51.91 13.59,52.99 13.59,56.13 12.45,57.28 11.53,57.28 9.91,58.9 9.91,64.52 9.27,65.15 U9.6
DP: length 17.9
  Top Layer w0.254: R49.1 1.78,22.15 U16.9 1.65,20.96 2.13,20.47 2.13,18.19 4.13,16.19 D3.3 D3.4 4.13,12.48 7.87,8.74
DP1: length 117.6
  Top Layer w0.254: U15.5 44.96,13.34 46.35,14.73 46.35,17.91 53.47,25.02 53.47,34.19 58.29,39.02 58.29,48.39 56.9,49.78 28.08,49.78 24.51,46.22 24.51,43.56 22.99,42.04 13.98,42.04 12.45,40.5 12.45,31.21 10.54,29.31 U16.1 10.54,27.41 7.9,24.77 2.53,24.77 R49.2
DP2: length 49.4
  Top Layer w0.254: U10.5 5.21,74.52 3.3,72.61 3.3,52.96 5.38,50.88 5.38,27.84 U16.5
DP3: length 46.6
  Top Layer w0.254: U9.5 10.54,64.9 10.29,64.64 10.29,61.85 11.18,60.96 11.18,58.17 11.68,57.66 12.6,57.66 13.97,56.29 13.97,53.85 ; 13.97,52.83 13.97,53.85 ; 13.97,52.83 12.66,51.53 ; 13.97,52.83 12.66,51.53 ; 13.97,52.83 13.97,53.85 ; 12.66,51.53 11.04,51.53 8.89,49.37 8.89,29.94 8,29.05 U16.3
DTR: length 6.8
  Top Layer w0.254: Q3.2 54.55,14.29 R19.1 54.24,14.61 49.61,14.61
EN: length 34.1
  Top Layer w0.254: v1(58.93,18.16) 58.99,18.16 C35.2 59.58,19.37 58.88,20.07 Q2.3 ; v1(77.98,25.65) 77.98,27.54 77.98,27.55 77.98,28.42 77.7,28.7 75.45,28.7 R21.1 74.62,29.53 C33.2
  Bottom Layer w0.254: v1(77.98,25.65) 70.48,18.16 v1(58.93,18.16)
ESP_RX: length 35.4
  Top Layer w0.254: U15.2 v1(45.47,17.15) ; U12.36 v1(75.44,11.56)
  Bottom Layer w0.254: v1(75.44,11.56) 51.82,11.56 46.23,17.15 v1(45.47,17.15)
ESP_TX: length 36.9
  Top Layer w0.254: U15.3 v1(45.47,15.88) ; U12.37 v1(76.71,11.56)
  Bottom Layer w0.254: v1(76.71,11.56) 75.82,10.67 74.8,10.67 74.29,11.18 51.66,11.18 46.96,15.88 v1(45.47,15.88)
ETH_CS: length 42
  Top Layer w0.254: v1(38.35,39.37) 37.33,39.37 R39.2 36.82,40.63 37.34,41.15 39.12,41.15 39.4,41.43 U21.1 ; v1(62.61,26.92) 62.61,25.9 U12.15 ; U23.32 v1(43.45,32.26)
  Inner2 w0.254: v1(43.45,32.26) 43.45,31.48 45.72,29.21 61.09,29.21 62.61,27.69 v1(62.61,26.92)
  Bottom Layer w0.254: v1(38.35,39.37) 38.35,37.59 41.78,34.16 41.78,32 42.16,31.62 42.81,31.62 v1(43.45,32.26)
ETH_INT: length 43.7
  Top Layer w0.254: v1(37.72,37.59) 36.96,38.35 R38.2 ; v1(41.15,32.39) 41.45,32.68 U23.36 ; U12.21 62.37,18.16 61.48,17.27 v1(61.34,17.27)
  Inner2 w0.254: v1(41.15,32.39) 44.7,28.83 59.94,28.83 61.34,27.43 v1(61.34,17.27)
  Bottom Layer w0.254: v1(37.72,37.59) 41.15,34.16 v1(41.15,32.39)
ETH_LEDS: length 57.2
  Top Layer w0.254: v1(33.02,4.19) 25.17,4.19 22.44,6.92 U22.4 ; v1(68.07,8) 68.83,8.76 71.23,8.76 71.63,9.17 U12.33
  Bottom Layer w0.254: v1(33.02,4.19) 33.4,3.81 38.73,3.81 40.89,1.65 63.88,1.65 65.02,2.79 65.02,4.06 66.29,5.33 66.29,6.66 67.64,8 v1(68.07,8)
ETH_RST: length 54.8
  Top Layer w0.254: v1(64.01,26.16) 64.01,27.54 U12.14 ; v1(30.1,39.37) 28.71,39.37 R27.2
  Inner2 w0.254: v1(64.01,26.16) 64.01,36.13 60.39,39.75 59.18,39.75 58.71,40.22 58.71,41.42 57.34,42.8 40.59,42.8 39.83,43.56 32.51,43.56 30.1,41.15 v1(30.1,39.37)
FE_DEBUG: length 23.1
  Top Layer w0.254: U8.15 85.61,68.71 86.49,69.59 86.49,89.29 R7.2
GPIO0: length 9
  Top Layer w0.254: Q3.3 59.75,15.24 C34.2 60.45,12.19 62.6,10.05 U12.27
HV_RX: length 68.6
  Top Layer w0.254: v1(82.55,72.52) U8.18 ; U7.4 58.96,26.54 57.15,26.54 56.39,27.31 56.39,35.18 59.74,38.53 62.66,38.53 66.04,41.91 71.12,41.91 71.37,41.66 v1(71.37,41.15)
  Inner2 w0.254: v1(82.55,72.52) 82.55,62.48 76.45,56.39 76.45,48.61 70.87,43.02 70.87,42.42 71.37,41.91 v1(71.37,41.15)
HV_TX: length 46.1
  Top Layer w0.254: v1(81.41,71.25) U8.17 ; v1(70.48,41.28) 69.98,40.77 69.98,38.48 68.07,36.58 66.69,36.58 66.5,36.77 U6.2
  Inner2 w0.254: v1(81.41,71.25) 82.17,70.49 82.17,62.64 76.07,56.55 76.07,48.77 70.48,43.18 v1(70.48,41.28)
INT_TOESP: length 11.1
  Top Layer w0.254: U12.13 65.28,27.54 v1(65.28,25.91) ; v1(64.9,28.96) 64.77,29.08 64.77,33.66 65.55,34.43 U6.4
  Bottom Layer w0.254: v1(64.9,28.96) 64.9,26.29 v1(65.28,25.91)
INT_TOTINY: length 5.1
  Top Layer w0.254: U12.17 62.61,23.11 59.82,23.11 58.92,24.01 U7.2
IO18: length 2.2
  Top Layer w0.254: R22.1 67.82,29.7 67.82,27.55
KEY1: length 17.3
  Top Layer w0.254: 84.99,58.36 84.8,58.36 83.69,59.47 83.69,60.58 83.06,61.21 77.6,61.21 76.84,61.98 76.84,66.8 76.2,67.44 U8.7
KEY2: length 6.4
  Top Layer w0.254: U3.4 76.42,58.49 75.44,59.47 75.44,63.63 U8.10
LED_DATA: length 101.7
  Top Layer w0.254: U8.13 v1(80.9,66.17)
  Inner2 w0.254: 10.39,33.78 19.4,42.8 23.75,42.8 28.45,47.5 56.91,47.5 58.69,45.72 62.74,45.72 65.41,43.05 67.44,43.05 70.74,46.36 70.74,58.55 69.98,59.31 69.98,62.74 73.41,66.17 v1(80.9,66.17)
MISO: length 51.5
  Top Layer w0.254: v1(70.61,25.78) 70.61,27.3 U12.9 ; U21.4 36.58,44.1 36.58,47.12 36.96,47.5 38.97,47.5 J4.7
  Inner2 w0.254: J4.7 42.91,43.56 58.19,43.56 70.61,31.14 v1(70.61,25.78)
MOSI: length 55.2
  Top Layer w0.254: U12.7 v1(72.9,25.78) ; v1(41.15,37.08) 41.95,36.29 U23.35
  Inner2 w0.254: J4.6 45.07,43.94 58.35,43.94 72.9,29.39 v1(72.9,25.78)
  Bottom Layer w0.254: v1(41.15,37.08) 41.15,40.01 41.91,40.77 41.91,44.85 J4.6
NFC_CS: length 40.2
  Top Layer w0.254: U12.6 v1(74.17,25.91)
  Inner2 w0.254: v1(74.17,25.91) 74.17,28.66 58.51,44.32 47.12,44.32 45.58,45.86 J4.5
  Bottom Layer w0.254: v1(74.17,25.91) 74.17,25.91
NFC_IRQ: length 33.5
  Top Layer w0.254: v1(75.56,25.91) 75.56,27.42 U12.5
  Inner2 w0.254: J4.2 54.47,44.7 58.67,44.7 75.56,27.81 v1(75.56,25.91)
NFC_PWR: length 21.3
  Top Layer w0.254: U12.12 66.55,27.54 v1(66.55,25.78) ; v1(59.69,40.39) 59.69,41.83 U13.4
  Inner2 w0.254: v1(66.55,25.78) 66.55,34.13 60.29,40.39 v1(59.69,40.39)
NFC_RSTO: length 31.4
  Top Layer w0.254: U12.4 v1(76.71,26.04)
  Inner2 w0.254: v1(76.71,26.04) 76.71,27.2 58.82,45.09 56.62,45.09 J4.1
NO: length 108.8
  Top Layer w0.254: U8.11 v1(86.49,63.63) ; U18.2 v1(43.18,3.81)
  Inner2 w0.254: v1(43.18,3.81) 45.97,1.02 79.63,1.02 81.28,2.67 81.28,48.9 80.01,50.17 80.01,59.18 84.45,63.63 v1(86.49,63.63)
NO_HP: length 29.3
  Top Layer w0.254: U18.4 45.24,5.11 47.88,7.75 54.48,7.75 57.4,4.83 69.14,4.83 70.56,6.25
RTS: length 9.2
  Top Layer w0.254: U15.14 52.58,15.88 53.21,16.51 53.21,18.17 R20.1 54.55,19.12 Q2.2
RXN: length 12
  Top Layer w0.203: 39.69,20.83 38.92,21.59 37.35,21.59 R48.2 ; 39.69,20.83 42.93,20.83 43.56,21.46 43.56,25.36 U23.5 ; 39.69,20.83 C61.2
RXP: length 16.1
  Top Layer w0.203: U23.6 43.95,21.14 43.13,20.32 40.64,20.32 40.39,20.07 38.85,20.07 R47.2 37.35,20.07 34.23,20.07 C60.2
SCK: length 60.3
  Top Layer w0.254: U23.33 42.95,35.03 42.54,35.43 42.54,36.58 41.45,37.67 40.33,37.67 40,38 40,41.02 40.26,41.28 40.26,44.32 39.88,44.7 39.23,44.7 J4.8 ; U12.10 v1(69.09,25.78)
  Inner2 w0.254: v1(69.09,25.78) 69.09,32.12 58.04,43.18 40.75,43.18 J4.8
  Bottom Layer w0.254: v1(69.09,25.78) 69.09,25.78
SW_TYPE: length 36.9
  Top Layer w0.254: R24.1 67.04,1.27 69.18,3.41 ; v1(77.98,11.68) 77.98,10.05 77.98,10.05
  Bottom Layer w0.254: v1(77.98,11.68) 77.98,10.03 71.35,3.41 69.18,3.41
SWITCH1: length 78
  Top Layer w0.254: U8.14 v1(80.9,67.44) ; U1.4 29.25,45.72 v1(29.97,45.72)
  Inner2 w0.254: v1(80.9,67.44) 73.28,67.44 69.47,63.63 69.47,59.06 70.23,58.29 70.23,48.36 68.87,46.99 65.53,46.99 v1(64.9,46.36)
  Bottom Layer w0.254: v1(29.97,45.72) 31.12,45.72 36.32,50.93 60.32,50.93 v1(64.9,46.36)
SWITCH2: length 43.5
  Top Layer w0.254: U8.12 v1(80.9,64.9) ; 61.28,45.06 v1(62.23,45.06)
  Inner2 w0.254: v1(62.23,45.06) 64.61,42.67 67.69,42.67 71.37,46.36 71.37,58.85 70.54,59.69 70.54,61.9 73.53,64.9 v1(80.9,64.9)
TEMP: length 46.3
  Top Layer w0.254: 67.79,6.25 69.8,8.26 78.49,8.26 79.25,9.02 79.25,10.04 ; R18.1 72.38,35.19 v1(73.41,34.16) U14.4 ; 79.25,10.04 v1(79.25,25.91) ; 79.25,10.04 U12.39
  Bottom Layer w0.254: v1(79.25,25.91) 79.25,32 77.09,34.16 v1(73.41,34.16)
TINY_RX: length 96.6
  Top Layer w0.254: U8.8 72.77,66.17 69.98,63.37 69.98,48.93 68.42,47.37 65.56,47.37 64.9,48.04 64.9,49.18 62.39,51.69 27.27,51.69 23.34,47.75 19.84,47.75 18.67,48.93 18.67,62.01 16.29,64.39 14.86,64.39 14.35,64.9 U9.2
TINY_TX: length 97.2
  Top Layer w0.254: U9.3 13.08,64.87 13.94,64.01 16.13,64.01 18.29,61.85 18.29,48.77 19.69,47.37 23.5,47.37 27.43,51.31 62.23,51.31 64.52,49.02 64.52,47.88 65.41,46.99 68.58,46.99 70.36,48.77 70.36,62.36 72.9,64.9 U8.9
TXN: length 25.3
  Top Layer w0.203: U23.1 41.45,24.94 39.93,23.42 29.36,23.42 27.74,21.79 27.74,20.12 26.93,19.31 R43.1 27.33,18.91 27.33,14.94 27.58,14.68 28.74,14.68 J7.2
TXP: length 26.1
  Top Layer w0.203: U23.2 41.95,24.8 40.16,23.01 29.62,23.01 28.14,21.54 28.14,20.13 R42.1 28.1,19.31 27.74,18.95 27.74,15.44 v1(27.94,15.24)
  Bottom Layer w0.203: v1(27.94,15.24) 28.07,15.11 28.07,12.74
UART_MODE: length 144.1
  Top Layer w0.254: SW3.7 14.99,97.08 10.92,93.02 v1(10.92,86.87) 10.92,84.83 R9.2 ; U8.2 v1(69.98,73.79)
  Inner2 w0.254: v1(69.98,73.79) 67.94,71.76 67.94,58.42 68.71,57.66 68.71,48.99 68.23,48.51 59.5,48.51 56.07,51.94 30.74,51.94 27,48.21 19.95,48.21 19.05,49.11 19.05,85.34 17.52,86.87 v1(10.92,86.87)
UPDI: length 125
  Top Layer w0.254: NOREF.49 7.75,70.99 12.82,70.99 R8.1 17.53,71.88 19.05,70.36 19.05,49.08 20,48.13 23.18,48.13 27.12,52.07 62.55,52.07 65.28,49.34 65.28,48.19 65.72,47.75 68.26,47.75 69.6,49.08 69.6,66.29 72.64,69.34 81.79,69.34 82.42,69.98 U8.16
VLED: length 10.9
  Top Layer w0.254: C44.2 18.48,9.71 19.37,8.82 U22.1 19.59,8.89 20.57,8.89 20.83,8.64 20.83,4.56 R45.2 R46.2
VNFC: length 15.2
  Top Layer w0.254: C24.2 55.77,43.9 U13.1 57.4,44.04 57.4,47.12 57.02,47.5 49.64,47.5 J4.4
VSW: length 7.6
  Top Layer w0.254: 62.25,6.25 62.25,7.66 C41.1 60.46,8.96 U19.4 U19.5
VUSB: length 14.9
  Top Layer w0.254: U17.4 10.16,15.14 10.16,13.81 U17.5 ; U17.5 10.17,13.53 10.41,13.28 10.41,10.74 ; U17.5 9.63,13.78 C38.1 ; v1(5.08,14.1) D3.5
  Bottom Layer w0.254: v1(5.08,14.1) 7.05,14.1 10.41,10.74
W_ACT: length 40.3
  Top Layer w0.254: J7.11 36.6,3.78 v1(35.81,4.57) ; U23.27 45.95,32.77 44.7,31.53 v1(44.7,31.5)
  Bottom Layer w0.254: v1(44.7,31.5) 45.47,32.26 45.97,32.26 46.48,31.75 46.48,31.24 45.47,30.23 45.47,26.67 39.37,20.57 39.37,12.03 35.81,8.48 v1(35.81,4.57)
W_LINK: length 40.2
  Top Layer w0.254: v1(45.72,31.5) 45.72,32 46.95,33.23 U23.25
  Bottom Layer w0.254: J7.10 28.42,1.62 38.99,12.19 38.99,20.73 44.96,26.7 44.96,30.73 v1(45.72,31.5)
W_MISO: length 15.6
  Top Layer w0.254: U23.34 v1(42.45,32.26) ; v1(38.35,42.93) U21.2
  Bottom Layer w0.254: v1(38.35,42.93) 37.72,42.29 37.72,40.89 39.04,39.57 39.04,37.67 42.45,34.26 v1(42.45,32.26)
W_RST: length 8.9
  Top Layer w0.254: U20.3 38.43,37.29 37.97,36.83 R36.2 39.37,34.28 39.37,32.47 U23.37
W_XI: length 10.1
  Top Layer w0.254: X2.3 46.43,41.78 47.24,41.78 47.62,41.4 47.62,38.93 C59.1 46.54,37.41 R40.1 44.45,35.31 U23.30
W_XO: length 7
  Top Layer w0.254: X2.1 44.52,37.97 C56.1 44.39,36.76 R40.2 43.95,35.31 U23.31
$1N8540: length 1.5
  Top Layer w0.254: DS2.2 71.07,29.43 R17.1
$1N32140: length 1.8
  Top Layer w0.254: U13.3 57.26,41.27 R16.1
$1N32545: length 9.3
  Top Layer w0.254: R20.2 55.13,21.59 57.15,21.59 57.53,21.21 57.53,17.15 56.58,16.19 Q3.1
$1N32546: length 6.6
  Top Layer w0.254: Q2.1 57.15,20.17 57.15,18.67 54.47,15.99 R19.2
$3N29171: length 23
  Top Layer w0.254: C7.2 80.07,48.9 77.09,48.9 74.51,51.48 J2.4 75.44,52.49 75.44,58.93 74.93,59.44 U3.2 73.14,59.44 R5.2
  Bottom Layer w0.254: 74.99,52.05 J2.4
$3N29172: length 17.4
  Top Layer w0.254: C10.1 85.98,50.59 J2.1 83.69,52.88 83.69,58.93 83.31,59.31 U5.2 81.27,59.31 R6.2
$3N32501: length 10.9
  Top Layer w0.254: U4.2 9.46,54.61 C8.2 10.21,53.86 ; 10.21,53.86 10.39,53.68 v1(10.39,52.45) ; 10.21,53.86 R4.2
  Bottom Layer w0.254: 10.39,47.12 v1(10.39,52.45)
$3N35905: length 2.1
  Top Layer w0.254: Q1.1 80.59,83.48 R2.2
$3N35907: length 6.2
  Top Layer w0.254: Q1.3 81.73,85.68 D1.2 80.8,87.57 LS1.2
$3N41245: length 16.8
  Top Layer w0.254: U2.2 62.23,48.58 C6.2 ; R3.1 60.84,49.28 C6.2 ; C6.2 60.64,50.17 v1(59.06,50.17)
  Bottom Layer w0.254: v1(59.06,50.17) 59.69,50.17 64.64,45.21 SW2.2
$3N41285: length 15.4
  Top Layer w0.254: U1.2 v1(30.1,46.86) ; v1(26.42,46.48) 25.97,46.04 C4.2 25.97,42.09 R1.1
  Bottom Layer w0.254: SW1.2 25.02,45.09 v1(26.42,46.48) 27.05,47.12 29.84,47.12 v1(30.1,46.86)
$4N1194: length 4.9
  Top Layer w0.254: D4.2 16.43,14.99 15.23,13.78 C37.2 13.97,13.53 U17.1
$4N1196: length 2.3
  Top Layer w0.254: U17.3 12.48,16.98 R23.1
$4N3426: length 5.4
  Top Layer w0.254: X1.3 14.59,22.72 13.89,22.02 U16.16
$4N3427: length 5.5
  Top Layer w0.254: X1.1 9.27,22.42 U16.15
$4N3429: length 2.8
  Top Layer w0.254: U16.13 6.73,21.27 C39.2
$4N3431: length 6.1
  Top Layer w0.254: U16.14 8,21.02 8.19,20.83 11.62,20.83 C40.2
$5N738: length 4.8
  Top Layer w0.254: R25.1 53.09,8.13 55.28,8.13 U19.3
$7N563: length 3.6
  Top Layer w0.254: R26.1 18.29,6.1 19.12,6.92 U22.3
$7N1020: length 5.7
  Top Layer w0.254: U23.45 38.88,28.47 38.3,27.89 38.3,26.12 R28.2
$7N1025: length 4.8
  Top Layer w0.254: U23.44 38.75,28.97 37.85,28.07 37.85,27.19 R29.2
$7N1030: length 3.9
  Top Layer w0.254: U23.43 38.6,29.47 R30.2
$7N1212: length 3.4
  Top Layer w0.254: R31.2 37.58,29.97 U23.42
$7N1216: length 3.2
  Top Layer w0.254: U23.41 37.09,30.47 R32.2
$7N1220: length 3.7
  Top Layer w0.254: R33.2 37.59,32.26 38.88,30.97 U23.40
$7N1225: length 4.6
  Top Layer w0.254: U23.39 39.11,31.47 38.35,32.23 38.35,33.06 37.63,33.78 R34.2
$7N1267: length 5.1
  Top Layer w0.254: R35.2 38.86,33.27 38.86,32.26 39.15,31.97 U23.38
$7N2484: length 4.2
  Top Layer w0.254: U23.23 49.24,31.97 49.53,32.26 49.53,33.77 R41.1
$7N2526: length 3.3
  Top Layer w0.254: U23.22 49.5,31.47 49.93,31.89 49.93,32.59 C58.2
$7N2585: length 2.3
  Top Layer w0.254: C57.2 50.37,30.47 U23.20
$7N2734: length 2.4
  Top Layer w0.254: U23.10 45.95,24.72 46.74,23.93 R37.2
$7N3542: length 4
  Top Layer w0.254: R46.1 23.41,1.49 J7.9
$7N3923: length 6.2
  Top Layer w0.254: C62.2 31.95,19.31 R44.1 v1(30.48,17.78)
  Bottom Layer w0.254: J7.4 31.88,16.38 v1(30.48,17.78)
$7N3940: length 7.8
  Top Layer w0.254: 30.61,12.74 30.61,15.62 33.53,18.54 33.53,19.3
$7N4100: length 13.3
  Top Layer w0.203: C63.2 35.11,19.31 R48.1 R47.1 38.1,18.34 37.49,17.73 34.75,17.73 33.27,16.26 33.27,12.86 33.15,12.74
$7N4138: length 7.8
  Top Layer w0.203: J7.6 34.54,15.4 34.54,17.02 34.85,17.32 37.58,17.32 C61.1
$7N5537: length 19.9
  Top Layer w0.254: v1(32.15,3.3) 21.07,3.3 R45.1
  Bottom Layer w0.254: J7.12 37.33,3.3 v1(32.15,3.3)
$7N6987: length 1.8
  Top Layer w0.254: Q4.1 27.76,42.23 R27.1
$7N7003: length 12.9
  Top Layer w0.254: U20.2 41.28,40.78 v1(41.28,41.28) ; v1(32.64,41.28) Q4.3
  Bottom Layer w0.254: v1(41.28,41.28) 38.99,43.56 34.93,43.56 v1(32.64,41.28)
$8N1418: length 11.2
  Top Layer w0.254: D2.2 14.23,73.91 R8.2 9.4,71.88 7.75,73.53 U10.3
$8N1425: length 4.3
  Top Layer w0.254: U10.2 9.02,74.42 9.52,73.91 D2.1
$8N2039: length 2.4
  Top Layer w0.254: U9.4 11.81,67.63 C20.2
$8N2042: length 2.5
  Top Layer w0.254: C21.2 6.48,77.79 U10.4
$8N4459: length 2
  Top Layer w0.254: DS1.2 R7.1

## Copper pours and planes (outline as drawn; the poured copper is in the pictures)
GND on Bottom Layer: -2.03,112.9 91.06,112.9 91.06,-3.3 -2.03,-3.3
GND on Inner1: -3.94,-10.03 91.57,-10.03 91.57,107.82 -3.94,107.82
GND on Inner2: -18.67,99.06 95.76,99.06 95.76,-0.76 -18.67,-0.76

## Text on the board
Top Silkscreen Layer: Key Switch | Makerspace | RIT SHED | Designed By: Jim Heaney | Ver 2.3.2 | Aug 2024 | Access / Control / Core | Lite Edition
